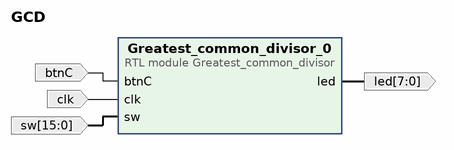
[diagram p0: block diagram of the top level]
# Vivado block design GCD, xc7a100tcsg324-3, Vivado 2016.4
create_bd_design GCD

create_bd_port -dir I clk
create_bd_port -dir I btnC
create_bd_port -dir I -from 15 -to 0 sw
create_bd_port -dir O -from 7 -to 0 led

create_bd_cell -type module -reference Greatest_common_divisor Greatest_common_divisor_0

# ---- connections ----

connect_bd_net [get_bd_ports btnC] [get_bd_pins Greatest_common_divisor_0/btnC]
connect_bd_net [get_bd_ports clk] [get_bd_pins Greatest_common_divisor_0/clk]
connect_bd_net [get_bd_ports sw] [get_bd_pins Greatest_common_divisor_0/sw]
connect_bd_net [get_bd_pins Greatest_common_divisor_0/led] [get_bd_ports led]

validate_bd_design
save_bd_design
